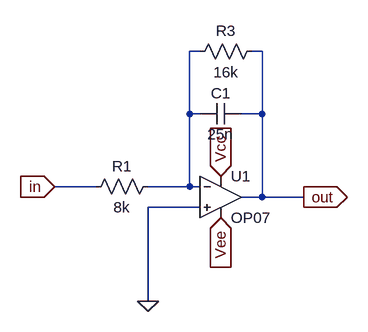
[diagram p0: schematic integrator.asc]
integrator.asc, the LTspice schematic file:
Version 4.1
SHEET 1 880 680
WIRE 80 0 64 0
WIRE 176 0 160 0
WIRE 64 96 64 0
WIRE 80 96 64 96
WIRE 176 96 176 0
WIRE 176 96 144 96
WIRE -80 208 -144 208
WIRE 64 208 64 96
WIRE 64 208 0 208
WIRE 80 208 64 208
WIRE 176 224 176 96
WIRE 176 224 144 224
WIRE 240 224 176 224
WIRE 80 240 0 240
WIRE 0 384 0 240
FLAG 112 256 Vee
IOPIN 112 256 In
FLAG 112 192 Vcc
IOPIN 112 192 In
FLAG 0 384 0
FLAG -144 208 in
IOPIN -144 208 In
FLAG 240 224 out
IOPIN 240 224 Out
SYMBOL OpAmps\\OP07 112 160 R0
SYMATTR InstName U1
SYMBOL cap 144 80 R90
WINDOW 0 0 32 VBottom 2
WINDOW 3 32 32 VTop 2
SYMATTR InstName C1
SYMATTR Value 25n
SYMBOL res 16 192 R90
WINDOW 0 0 56 VBottom 2
WINDOW 3 32 56 VTop 2
SYMATTR InstName R1
SYMATTR Value 8k
SYMBOL res 176 -16 R90
WINDOW 0 0 56 VBottom 2
WINDOW 3 32 56 VTop 2
SYMATTR InstName R3
SYMATTR Value 16k

The netlist it stands for:
* integrator.asc
X§U1 0 N001 Vcc Vee out LT1001  ; OP07, pins In+ In- V+ V- OUT
C1 out N001 25n
R1 N001 in 8k
R3 out N001 16k
.lib LTC.lib
.backanno
.end